# EAGLE design PCB-BI16-2x8 (EAGLE 6.5.0)

## Sheet 1 of 2
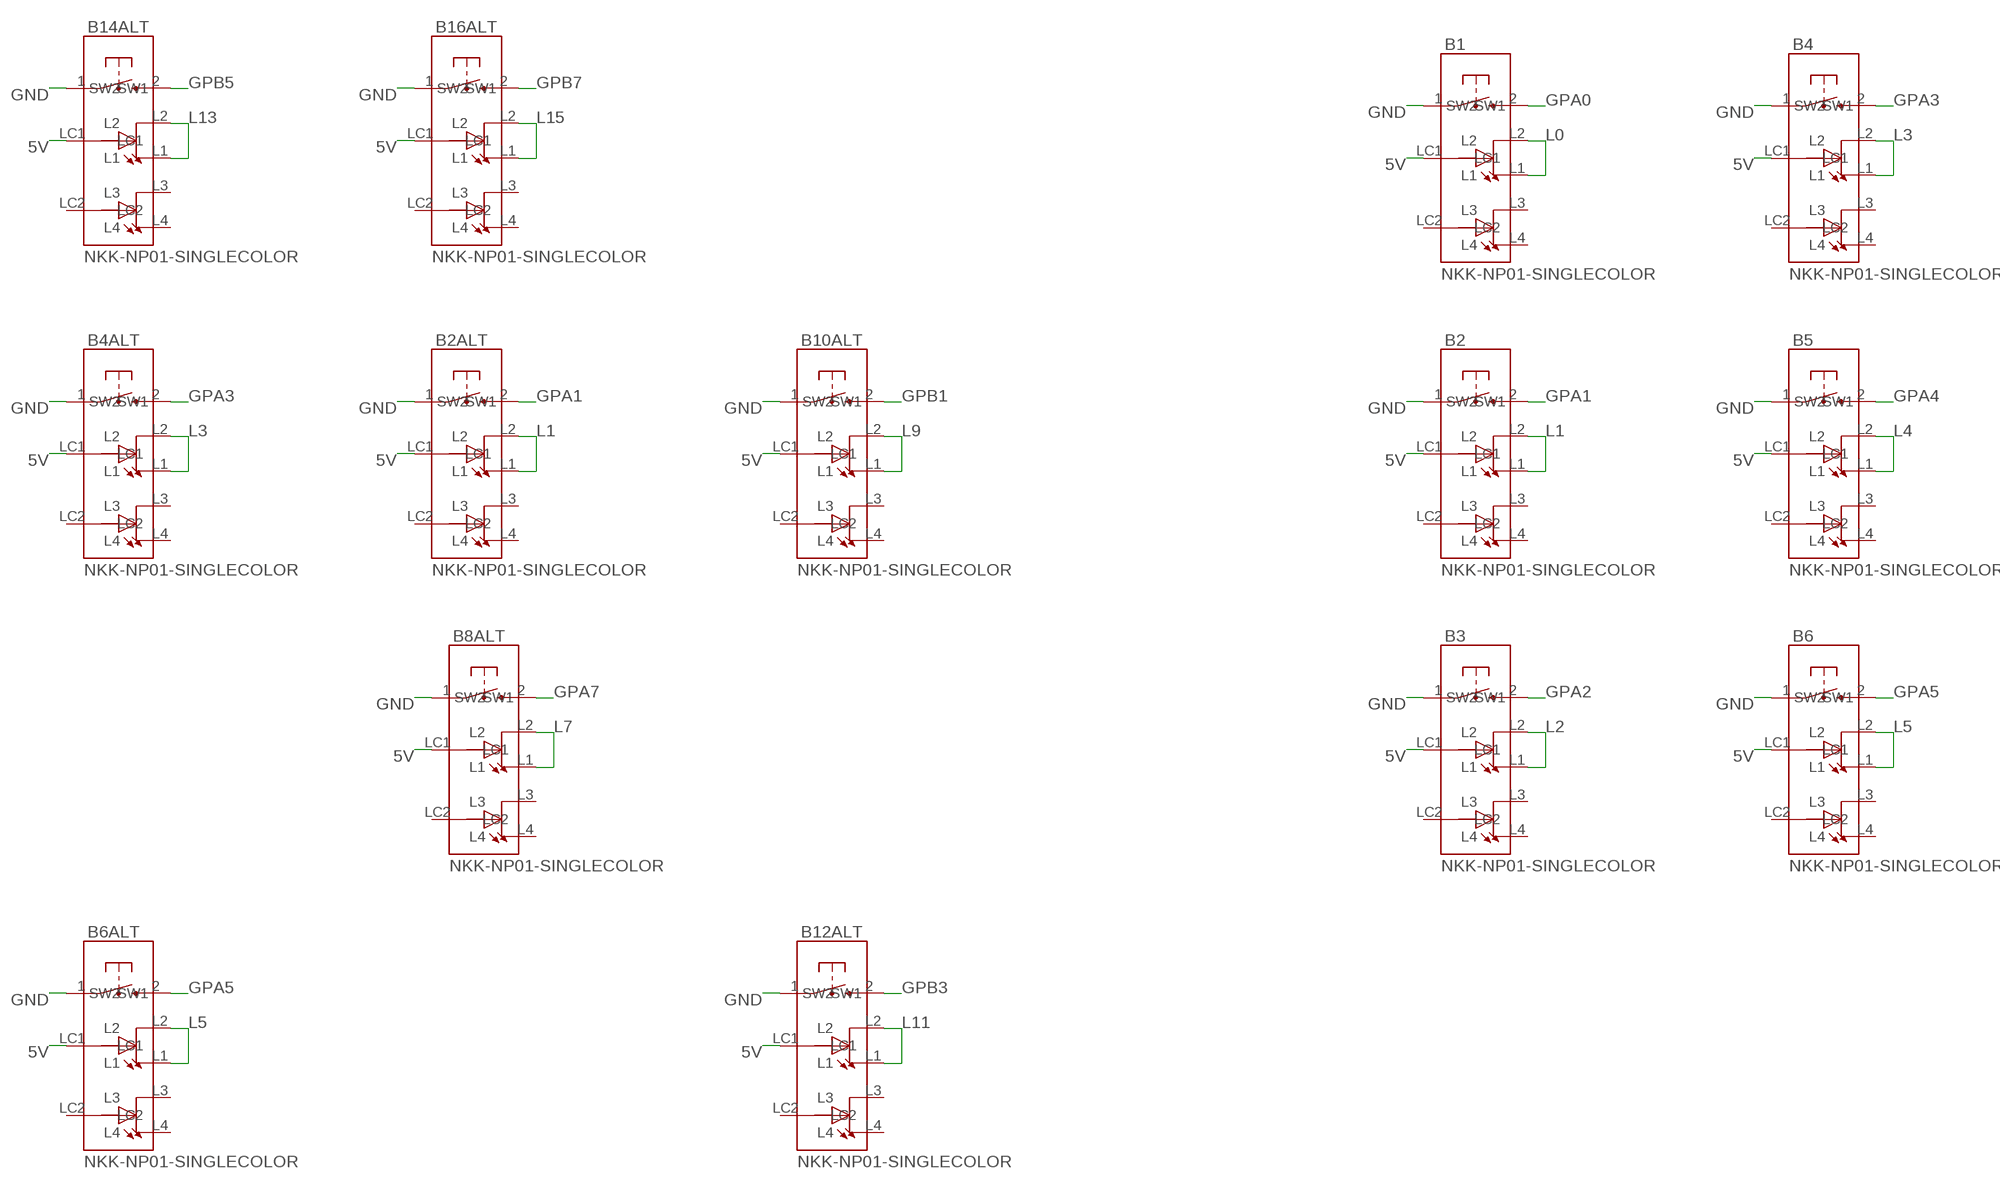
[diagram p0: schematic, sheet 1, part 1 of 2]
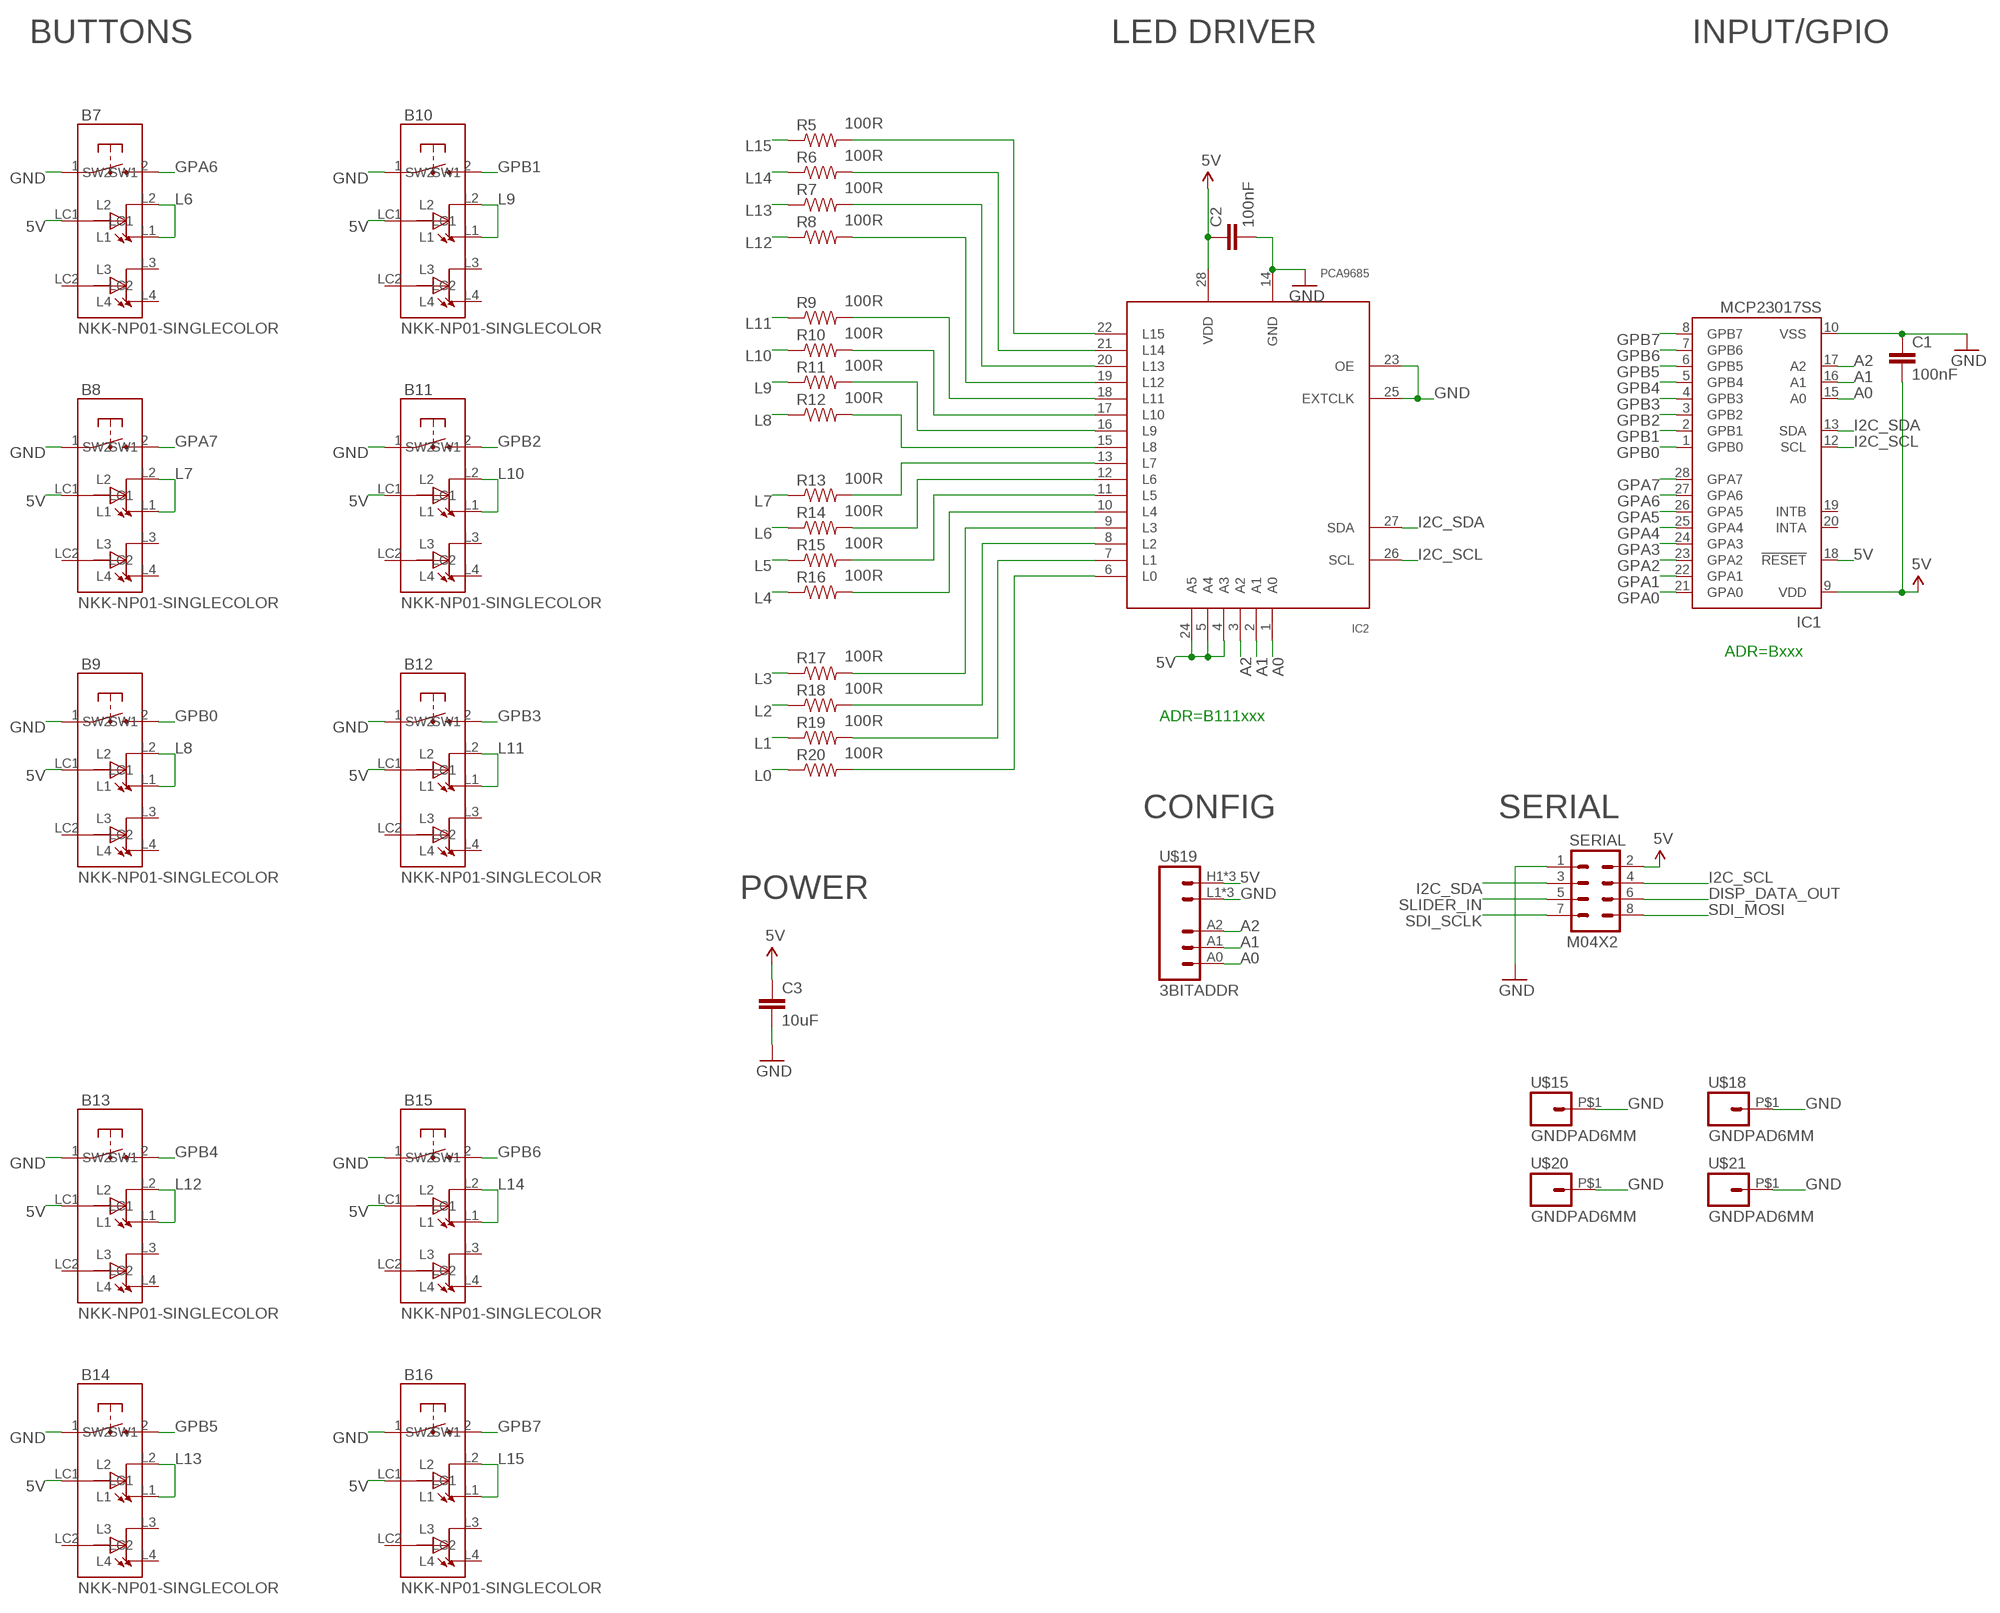
[diagram p1: schematic, sheet 1, part 2 of 2]

### Parts
B1  NKK-NP01-SINGLECOLOR  [NKK-NP01]
B2  NKK-NP01-SINGLECOLOR  [NKK-NP01]
B2ALT  NKK-NP01-SINGLECOLOR  [NKK-NP01]
B3  NKK-NP01-SINGLECOLOR  [NKK-NP01]
B4  NKK-NP01-SINGLECOLOR  [NKK-NP01]
B4ALT  NKK-NP01-SINGLECOLOR  [NKK-NP01]
B5  NKK-NP01-SINGLECOLOR  [NKK-NP01]
B6  NKK-NP01-SINGLECOLOR  [NKK-NP01]
B6ALT  NKK-NP01-SINGLECOLOR  [NKK-NP01]
B7  NKK-NP01-SINGLECOLOR  [NKK-NP01]
B8  NKK-NP01-SINGLECOLOR  [NKK-NP01]
B8ALT  NKK-NP01-SINGLECOLOR  [NKK-NP01]
B9  NKK-NP01-SINGLECOLOR  [NKK-NP01]
B10  NKK-NP01-SINGLECOLOR  [NKK-NP01]
B10ALT  NKK-NP01-SINGLECOLOR  [NKK-NP01]
B11  NKK-NP01-SINGLECOLOR  [NKK-NP01]
B12  NKK-NP01-SINGLECOLOR  [NKK-NP01]
B12ALT  NKK-NP01-SINGLECOLOR  [NKK-NP01]
B13  NKK-NP01-SINGLECOLOR  [NKK-NP01]
B14  NKK-NP01-SINGLECOLOR  [NKK-NP01]
B14ALT  NKK-NP01-SINGLECOLOR  [NKK-NP01]
B15  NKK-NP01-SINGLECOLOR  [NKK-NP01]
B16  NKK-NP01-SINGLECOLOR  [NKK-NP01]
B16ALT  NKK-NP01-SINGLECOLOR  [NKK-NP01]
C1  100nF  CAP0603-CAP  [0603-CAP]
C2  100nF  CAP0603-CAP  [0603-CAP]
C3  10uF  CAP0805  [0805]
IC1  MCP23017SS  [SSOP28]
IC2  PCA9685  [TSSOP28]
R5  100R  RESISTOR0603-RES  [0603-RES]
R6  100R  RESISTOR0603-RES  [0603-RES]
R7  100R  RESISTOR0603-RES  [0603-RES]
R8  100R  RESISTOR0603-RES  [0603-RES]
R9  100R  RESISTOR0603-RES  [0603-RES]
R10  100R  RESISTOR0603-RES  [0603-RES]
R11  100R  RESISTOR0603-RES  [0603-RES]
R12  100R  RESISTOR0603-RES  [0603-RES]
R13  100R  RESISTOR0603-RES  [0603-RES]
R14  100R  RESISTOR0603-RES  [0603-RES]
R15  100R  RESISTOR0603-RES  [0603-RES]
R16  100R  RESISTOR0603-RES  [0603-RES]
R17  100R  RESISTOR0603-RES  [0603-RES]
R18  100R  RESISTOR0603-RES  [0603-RES]
R19  100R  RESISTOR0603-RES  [0603-RES]
R20  100R  RESISTOR0603-RES  [0603-RES]
SERIAL  M04X2  [2X4]
U$15  GNDPAD6MM  [3.2MMPAD6MM]
U$18  GNDPAD6MM  [3.2MMPAD6MM]
U$19  3BITADDR  [3BITADDR]
U$20  GNDPAD6MM  [3.2MMPAD6MM]
U$21  GNDPAD6MM  [3.2MMPAD6MM]

### Nets
5V [Power]: B1.LC1 B2.LC1 B2ALT.LC1 B3.LC1 B4.LC1 B4ALT.LC1 B5.LC1 B6.LC1 B6ALT.LC1 B7.LC1 B8.LC1 B8ALT.LC1 B9.LC1 B10.LC1 B10ALT.LC1 B11.LC1 B12.LC1 B12ALT.LC1 B13.LC1 B14.LC1 B14ALT.LC1 B15.LC1 B16.LC1 B16ALT.LC1 C1.2 C2.1 C3.1 IC1.9(VDD) IC1.18(!RESET) IC2.4(A3) IC2.5(A4) IC2.24(A5) IC2.28(VDD) SERIAL.2 U$19.H1(VCC) U$19.H2(VCC) U$19.H3(VCC)
A0: IC1.15(A0) IC2.1(A0) U$19.A0
A1: IC1.16(A1) IC2.2(A1) U$19.A1
A2: IC1.17(A2) IC2.3(A2) U$19.A2
DISP_DATA_OUT: SERIAL.6
GND [Power]: B1.1(SW1) B2.1(SW1) B2ALT.1(SW1) B3.1(SW1) B4.1(SW1) B4ALT.1(SW1) B5.1(SW1) B6.1(SW1) B6ALT.1(SW1) B7.1(SW1) B8.1(SW1) B8ALT.1(SW1) B9.1(SW1) B10.1(SW1) B10ALT.1(SW1) B11.1(SW1) B12.1(SW1) B12ALT.1(SW1) B13.1(SW1) B14.1(SW1) B14ALT.1(SW1) B15.1(SW1) B16.1(SW1) B16ALT.1(SW1) C1.1 C2.2 C3.2 IC1.10(VSS) IC2.14(GND) IC2.23(OE) IC2.25(EXTCLK) SERIAL.1 U$15.P$1 U$18.P$1 U$19.L1(GND) U$19.L2(GND) U$19.L3(GND) U$20.P$1 U$21.P$1
GPA0: B1.2(SW2) IC1.21(GPA0)
GPA1: B2.2(SW2) B2ALT.2(SW2) IC1.22(GPA1)
GPA2: B3.2(SW2) IC1.23(GPA2)
GPA3: B4.2(SW2) B4ALT.2(SW2) IC1.24(GPA3)
GPA4: B5.2(SW2) IC1.25(GPA4)
GPA5: B6.2(SW2) B6ALT.2(SW2) IC1.26(GPA5)
GPA6: B7.2(SW2) IC1.27(GPA6)
GPA7: B8.2(SW2) B8ALT.2(SW2) IC1.28(GPA7)
GPB0 [Power]: B9.2(SW2) IC1.1(GPB0)
GPB1: B10.2(SW2) B10ALT.2(SW2) IC1.2(GPB1)
GPB2: B11.2(SW2) IC1.3(GPB2)
GPB3: B12.2(SW2) B12ALT.2(SW2) IC1.4(GPB3)
GPB4: B13.2(SW2) IC1.5(GPB4)
GPB5: B14.2(SW2) B14ALT.2(SW2) IC1.6(GPB5)
GPB6: B15.2(SW2) IC1.7(GPB6)
GPB7: B16.2(SW2) B16ALT.2(SW2) IC1.8(GPB7)
I2C_SCL: IC1.12(SCL) IC2.26(SCL) SERIAL.4
I2C_SDA: IC1.13(SDA) IC2.27(SDA) SERIAL.3
L0: B1.L1 B1.L2 R20.1
L1: B2.L1 B2.L2 B2ALT.L1 B2ALT.L2 R19.1
L2: B3.L1 B3.L2 R18.1
L3: B4.L1 B4.L2 B4ALT.L1 B4ALT.L2 R17.1
L4: B5.L1 B5.L2 R16.1
L5: B6.L1 B6.L2 B6ALT.L1 B6ALT.L2 R15.1
L6: B7.L1 B7.L2 R14.1
L7: B8.L1 B8.L2 B8ALT.L1 B8ALT.L2 R13.1
L8: B9.L1 B9.L2 R12.1
L9: B10.L1 B10.L2 B10ALT.L1 B10ALT.L2 R11.1
L10: B11.L1 B11.L2 R10.1
L11: B12.L1 B12.L2 B12ALT.L1 B12ALT.L2 R9.1
L12: B13.L1 B13.L2 R8.1
L13: B14.L1 B14.L2 B14ALT.L1 B14ALT.L2 R7.1
L14: B15.L1 B15.L2 R6.1
L15: B16.L1 B16.L2 B16ALT.L1 B16ALT.L2 R5.1
N$4: IC2.13(L7) R13.2
N$5: IC2.12(L6) R14.2
N$7: IC2.11(L5) R15.2
N$9: IC2.10(L4) R16.2
N$10: IC2.9(L3) R17.2
N$11: IC2.8(L2) R18.2
N$12: IC2.7(L1) R19.2
N$19: IC2.6(L0) R20.2
N$20: IC2.15(L8) R12.2
N$21: IC2.16(L9) R11.2
N$22: IC2.17(L10) R10.2
N$23: IC2.18(L11) R9.2
N$24: IC2.19(L12) R8.2
N$25: IC2.20(L13) R7.2
N$26: IC2.21(L14) R6.2
N$27: IC2.22(L15) R5.2
SDI_MOSI: SERIAL.8
SDI_SCLK: SERIAL.7
SLIDER_IN: SERIAL.5
Unconnected: B1.L3 B1.L4 B1.LC2 B2.L3 B2.L4 B2.LC2 B2ALT.L3 B2ALT.L4 B2ALT.LC2 B3.L3 B3.L4 B3.LC2 B4.L3 B4.L4 B4.LC2 B4ALT.L3 B4ALT.L4 B4ALT.LC2 B5.L3 B5.L4 B5.LC2 B6.L3 B6.L4 B6.LC2 B6ALT.L3 B6ALT.L4 B6ALT.LC2 B7.L3 B7.L4 B7.LC2 B8.L3 B8.L4 B8.LC2 B8ALT.L3 B8ALT.L4 B8ALT.LC2 B9.L3 B9.L4 B9.LC2 B10.L3 B10.L4 B10.LC2 B10ALT.L3 B10ALT.L4 B10ALT.LC2 B11.L3 B11.L4 B11.LC2 B12.L3 B12.L4 B12.LC2 B12ALT.L3 B12ALT.L4 B12ALT.LC2 B13.L3 B13.L4 B13.LC2 B14.L3 B14.L4 B14.LC2 B14ALT.L3 B14ALT.L4 B14ALT.LC2 B15.L3 B15.L4 B15.LC2 B16.L3 B16.L4 B16.LC2 B16ALT.L3 B16ALT.L4 B16ALT.LC2 IC1.19(INTB) IC1.20(INTA)

### Notes on the sheet
- BUTTONS | LED DRIVER | INPUT/GPIO
- ADR=Bxxx
- ADR=B111xxx
- CONFIG | SERIAL
- POWER

## Sheet 2 of 2

## Library data of the parts
B1 B2 B2ALT B3 B4 B4ALT B5 B6 B6ALT B7 B8 B8ALT B9 B10 B10ALT B11 B12 B12ALT B13 B14 B14ALT B15 B16 B16ALT = SKAARHOJ:NKK-NP01-SINGLECOLOR
C1-C3 = SparkFun:CAP: Capacitor Standard 0603 ceramic capacitor, and 0.1" leaded capacitor.
IC1 = microchip:MCP23017: http://ww1.microchip.com/downloads/en/DeviceDoc/21952a.pdf Source: http://ww1.microchip.com/downloads/en/DeviceDoc/21952a.pdf; MF: MICROCHIP; MPN: MCP23017-E/SS; OC_FARNELL: 1467674; OC_NEWARK: 31K2960
IC2 = wsmith:PCA9685
R5-R20 = SparkFun:RESISTOR: Resistor Basic schematic elements and footprints for 0603, 1206, and PTH resistors.
SERIAL = SparkFun:M04X2
U$15 U$18 U$20 U$21 = SKAARHOJ:GNDPAD
U$19 = SKAARHOJ:3BITADDR

## Net classes
0 default: width 0.203 mm, drill 0.305 mm, clearance 0.152 mm
1 Power: width 0.406 mm, drill 0.61 mm, clearance 0.203 mm

## Board
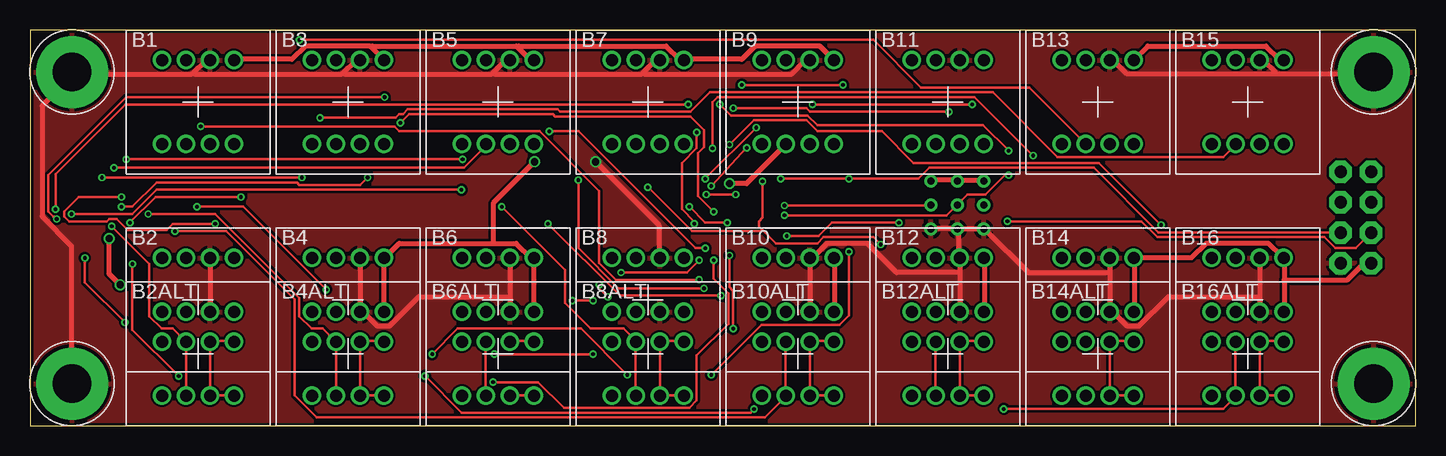
[diagram p2: board, top side]
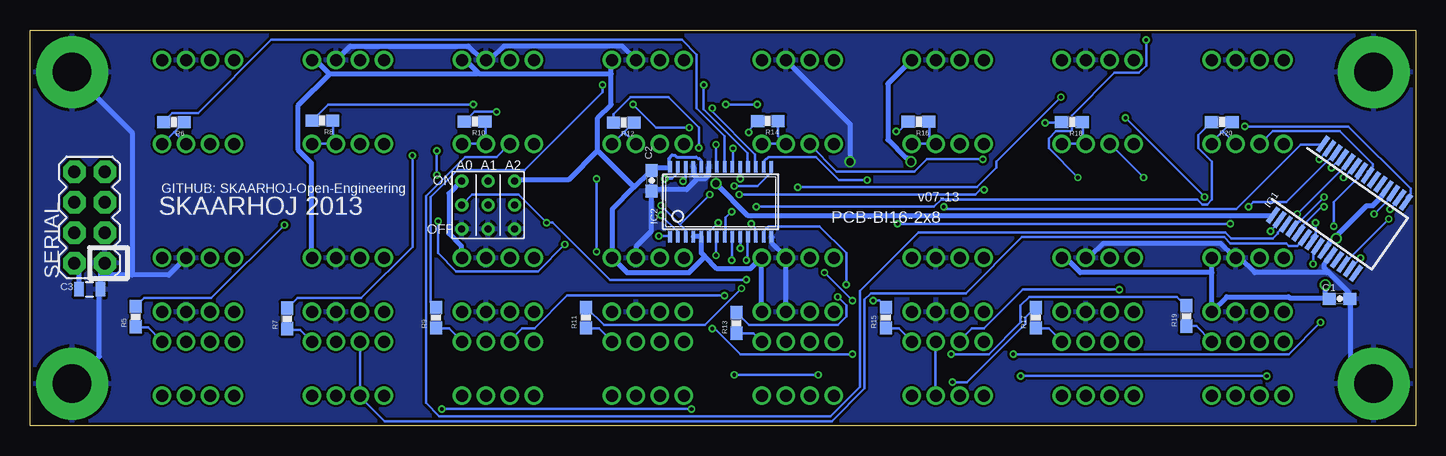
[diagram p3: board, bottom side, seen from below]

Size 115.5 x 33 mm. Coordinates in mm from the lower left corner, seen from the top.
Outline: 0,0 115.5,0 115.5,33 0,33 0,0
Copper layers (1*16): Top 0.035mm / dielectric 1.5mm / Bottom 0.035mm
Design rules "Fusion_eagle_rule_v1.1": minimum track width 6mil, minimum drill 12mil, track to track 6mil, track to pad 6mil, pad to pad 6mil, via to via 6mil, smd to smd 0mil, copper to edge 10mil, drill to drill 10mil, minimum pad ring 10mil, minimum via ring 6mil, stop-mask expansion 2mil, vias tented up to drill 100mil, thermal gap 10mil

### Footprints (pad centres in the part's own frame; a part is rotated, then mirrored left to right if it is on the bottom)
NKK-NP01 = drill 1: 1 1,3.5; 2 -1,-3.5; L1 3,-3.5; L2 1,-3.5; L3 -1,3.5; L4 -3,3.5; LC1 3,3.5; LC2 -3,-3.5
0603-CAP = smd 1.1 x 1: 1 -0.85,0; 2 0.85,0
0805 = smd 0.8 x 1.2: 1 -0.9,0; 2 0.9,0
SSOP28 = smd 0.4 x 1.5: 1 -4.225,-3.625; 2 -3.575,-3.625; 3 -2.925,-3.625; 4 -2.275,-3.625; 5 -1.625,-3.625; 6 -0.975,-3.625; 7 -0.325,-3.625; 8 0.325,-3.625; 9 0.975,-3.625; 10 1.625,-3.625; 11 2.275,-3.625; 12 2.925,-3.625; 13 3.575,-3.625; 14 4.225,-3.625; 15 4.225,3.625; 16 3.575,3.625; 17 2.925,3.625; 18 2.275,3.625; 19 1.625,3.625; 20 0.975,3.625; 21 0.325,3.625; 22 -0.325,3.625; 23 -0.975,3.625; 24 -1.625,3.625; 25 -2.275,3.625; 26 -2.925,3.625; 27 -3.575,3.625; 28 -4.225,3.625
TSSOP28 = smd 0.305 x 0.991: 1 -4.225,-2.918; 2 -3.575,-2.918; 3 -2.925,-2.918; 4 -2.275,-2.918; 5 -1.625,-2.918; 6 -0.975,-2.918; 7 -0.325,-2.918; 8 0.325,-2.918; 9 0.975,-2.918; 10 1.625,-2.918; 11 2.275,-2.918; 12 2.925,-2.918; 13 3.575,-2.918; 14 4.225,-2.918; 15 4.225,2.918; 16 3.575,2.918; 17 2.925,2.918; 18 2.275,2.918; 19 1.625,2.918; 20 0.975,2.918; 21 0.325,2.918; 22 -0.325,2.918; 23 -0.975,2.918; 24 -1.625,2.918; 25 -2.275,2.918; 26 -2.925,2.918; 27 -3.575,2.918; 28 -4.225,2.918
0603-RES = smd 1.1 x 1: 1 -0.85,0; 2 0.85,0
2X4 = drill 1.016 pad 1.88 octagon: 1 -3.81,-1.27; 2 -3.81,1.27; 3 -1.27,-1.27; 4 -1.27,1.27; 5 1.27,-1.27; 6 1.27,1.27; 7 3.81,-1.27; 8 3.81,1.27
3.2MMPAD6MM = drill 3.2 pad 6: P$1 0,0
3BITADDR = drill 0.6: A0 -2.2,0; A1 0,0; A2 2.2,0; H1 -2.2,2; H2 0,2; H3 2.2,2; L1 -2.2,-2; L2 0,-2; L3 2.2,-2

### Placement (x,y rotation side)
B1  14,27 0 top
B2  14,10.5 0 top
B2ALT  14,6 0 top
B3  26.5,27 0 top
B4  26.5,10.5 0 top
B4ALT  26.5,6 0 top
B5  39,27 0 top
B6  39,10.5 0 top
B6ALT  39,6 0 top
B7  51.5,27 0 top
B8  51.5,10.5 0 top
B8ALT  51.5,6 0 top
B9  64,27 0 top
B10  64,10.5 0 top
B10ALT  64,6 0 top
B11  76.5,27 0 top
B12  76.5,10.5 0 top
B12ALT  76.5,6 0 top
B13  89,27 0 top
B14  89,10.5 0 top
B14ALT  89,6 0 top
B15  101.5,27 0 top
B16  101.5,10.5 0 top
B16ALT  101.5,6 0 top
C1  6.33,10.58 180 bottom
C2  63.68,20.42 270 bottom
C3  110.53,11.36 0 bottom
IC1  6.33,18.1 325 bottom
IC2  57.92,18.67 0 bottom
R5  106.68,9.1 90 bottom
R6  103.51,25.3 180 bottom
R7  94.07,8.93 90 bottom
R8  91.11,25.43 180 bottom
R9  81.64,9.01 90 bottom
R10  78.43,25.36 180 bottom
R11  69.14,8.99 90 bottom
R12  66.01,25.28 180 bottom
R13  56.59,8.56 90 bottom
R14  53.99,25.41 180 bottom
R15  44.16,9.01 90 bottom
R16  41.43,25.34 180 bottom
R17  31.66,8.99 90 bottom
R18  28.64,25.31 180 bottom
R19  19.12,9.14 90 bottom
R20  16.14,25.33 180 bottom
SERIAL  110.53,17.36 90 bottom
U$15  3.5,3.5 0 top
U$18  112,3.5 0 top
U$19  77.31,18.39 0 bottom
U$20  3.5,29.5 0 top
U$21  112,29.5 0 top

### Tracks (layer width: path | path; a pad name or v marks a point on that pad's centre or on a via)
5V  (via drill 0.61)
  Top 0.406: B6ALT.LC1 41.96,9.51 41.96,13.98 B6.LC1 41.76,13.98 40.54,15.2 38.61,15.2 | B4ALT.LC1 29.46,9.51 29.46,13.98 B4.LC1 29.67,14.09 30.79,15.2 38.61,15.2 | v6.6,15.61 6.6,12.66 v7.52,11.75 | 28.45,31.56 29.46,30.54 B3.LC1 | 28.45,31.56 28.35,31.66 22.96,31.66 21.84,30.54 17.07,30.54 B1.LC1 | 40.64,31.56 40.54,31.66 28.55,31.66 28.45,31.56 | 40.64,31.56 41.66,30.54 41.96,30.54 B5.LC1 | 40.64,31.56 40.74,31.66 53.03,31.66 54.15,30.54 54.46,30.54 B7.LC1 54.66,30.54 59.33,30.54 60.45,31.66 65.84,31.66 66.95,30.54 B9.LC1 | B14ALT.LC1 92.05,9.51 92.05,13.98 B14.LC1 92.25,13.98 96.83,13.98 98.04,15.2 103.23,15.2 104.34,14.09 B16.LC1 104.55,13.98 104.55,12.15 | 104.55,12.15 104.55,9.51 B16ALT.LC1 | 104.55,12.15 109.83,12.15 111.15,13.47 111.76,13.47 SERIAL.2 | B12ALT.LC1 79.55,9.51 79.55,13.98 B12.LC1 | U$19.H3 75.18,20.49 77.22,20.49 U$19.H2 77.42,20.49 79.45,20.49 U$19.H1 | B10ALT.LC1 67.06,9.51 67.06,13.98 B10.LC1 | B15.LC1 104.44,30.54 104.14,30.54 103.02,31.66 93.17,31.66 92.05,30.54 B13.LC1 | 38.61,15.2 38.61,18.55 v42.06,22.01
  Bottom 0.254: 61.98,22.54 61.72,22.54 61.59,22.42 59.94,22.42 59.82,22.29 59.69,22.29 59.56,22.16 59.56,21.6 IC2.24
  Bottom 0.305: IC2.28 62.23,21.59 62.23,22.29 61.98,22.54
  Bottom 0.406: 6.71,15.71 7.21,15.2 7.21,15.1 7.42,14.9 7.42,14.8 7.62,14.59 IC1.9 | 6.71,15.71 4.06,18.35 3.56,18.35 2.85,19.06 2.85,19.16 2.64,19.37 2.64,19.47 2.44,19.67 IC1.18 | 16.97,12.76 16.97,9.72 B2ALT.LC1 16.97,9.51 15.75,10.73 10.57,10.73 10.46,10.63 7.21,10.63 C1.2 7.52,10.73 v7.52,11.75 | 16.97,12.76 16.97,13.98 B2.LC1 | 16.97,12.76 27.94,12.76 29.16,13.98 29.46,13.98 B4.LC1 | v6.6,15.61 6.71,15.71 | C3.1 111.45,11.44 111.45,13.17 111.76,13.47 SERIAL.2 | IC2.4 60.15,15.81 59.64,15.81 IC2.5 59.54,15.61 59.54,14.39 59.23,14.09 | 59.23,14.09 58.22,13.07 55.47,13.07 54.56,13.98 B8.LC1 54.56,13.78 54.56,9.51 B8ALT.LC1 | IC2.28 62.18,21.5 63.4,21.5 63.6,21.3 C2.1 63.8,21.2 65.13,19.88 | 65.13,19.88 66.95,18.05 66.95,14.09 B10.LC1 66.85,13.88 65.73,12.76 60.55,12.76 59.23,14.09 | 67.06,29.32 67.06,26.79 68.17,25.67 68.17,22.92 | 67.06,29.32 67.06,30.44 B9.LC1 | 65.13,19.88 68.17,22.92 | 78.13,29.43 78.03,29.32 67.06,29.32 | 78.13,29.43 79.15,30.44 79.45,30.44 B11.LC1 | 90.53,29.32 91.64,30.44 91.95,30.44 B13.LC1 | 90.53,29.32 78.23,29.32 78.13,29.43 | 68.17,22.92 70.61,20.49 75.08,20.49 U$19.H3 | B12.LC1 79.55,14.09 79.55,15 80.57,16.02 80.57,19.37 79.55,20.38 U$19.H1 | 90.53,29.32 93.17,26.68 93.17,23.03 92.05,21.91 92.05,14.09 B14.LC1 | v42.06,22.01 42.37,22.31 42.47,22.31 43.99,23.84 43.99,28.51 42.06,30.44 B5.LC1
A0  (via drill 0.3)
  Top 0.203: v63.09,15.81 65.73,15.81 66.85,16.93 v72.44,16.93 | v14.22,24.96 30.38,24.96 30.79,24.55 42.47,24.55 47.45,19.57 47.45,13.58 48.87,12.15 v55.78,12.15
  Bottom 0.203: v63.09,15.81 62.18,15.81 IC2.1 | U$19.A0 79.45,18.45 78.64,19.27 74.78,19.27 v72.44,16.93 71.93,16.93 67.16,12.15 v55.78,12.15 | v14.22,24.96 5.59,24.96 0.41,19.77 0.41,19.37 0.71,19.06 0.71,18.66 IC1.15
A1  (via drill 0.3)
  Top 0.203: v62.89,17.54 76.4,17.54 77.22,18.35 U$19.A1 77.32,18.45 78.13,19.27 79.65,19.27 81.28,20.89 v81.58,20.89 | v2.13,18.05 2.13,20.99 7.92,26.79 v54.86,26.79 | v57.51,26.79 58.42,25.87 64.82,25.87 65.63,25.06 79.45,25.06 v81.58,22.92
  Bottom 0.203: v62.89,17.54 61.57,16.22 61.57,15.81 IC2.2 | v2.13,18.05 1.42,18.76 1.42,18.96 IC1.16 | v57.51,26.79 v54.86,26.79 | v81.58,20.89 v81.58,22.92
A2  (via drill 0.3)
  Top 0.203: v62.89,18.35 75.08,18.35 U$19.A2 | v3.45,17.64 8.53,17.64 10.57,19.67 v35.97,19.67 | v58.83,19.27 v56.39,19.27
  Bottom 0.203: v62.89,18.35 61.32,16.78 | 61.32,16.78 60.86,16.32 60.86,15.81 IC2.3 | v3.45,17.64 1.93,19.16 1.93,19.37 IC1.17 | v35.97,19.67 36.27,19.67 36.68,19.27 v56.39,19.27 | 61.32,16.78 v58.83,19.27
GND  (via drill 0.61)
  Top 0.406: 102.51,10.73 102.51,13.98 B16.1 | 102.51,10.73 102.51,9.51 B16ALT.1 | B10ALT.1 65.02,9.51 65.02,13.98 B10.1 65.23,13.98 66.45,15.2 69.8,15.2 72.24,12.76 77.52,12.76 | 90.02,12.76 90.02,13.98 B14.1 | 90.02,12.76 90.02,9.51 B14ALT.1 90.22,9.51 91.44,8.29 92.46,8.29 94.89,10.73 102.51,10.73 | U$19.L3 75.18,16.42 77.22,16.42 U$19.L2 | U$19.L2 77.52,16.42 79.45,16.42 U$19.L1 79.65,16.32 83.21,12.76 90.02,12.76 | 77.52,12.76 77.52,13.98 B12.1 77.42,14.19 77.42,16.22 U$19.L2 | 77.52,12.76 77.52,9.51 B12ALT.1 | 40.03,10.73 40.03,13.98 B6.1 | 40.03,10.73 40.03,9.51 B6ALT.1 | B4.1 27.53,13.98 27.53,9.51 B4ALT.1 27.74,9.51 28.96,8.29 29.97,8.29 32.41,10.73 40.03,10.73 | B2ALT.1 15.04,9.51 15.04,13.98 B2.1 | 103.83,29.43 103.94,29.32 111.86,29.32 111.96,29.43 U$21.P$1 | 103.83,29.43 102.82,30.44 102.51,30.44 B15.1 | B13.1 90.02,30.44 90.32,30.44 91.44,29.32 103.73,29.32 103.83,29.43 | 13.61,29.43 13.51,29.32 3.66,29.32 3.56,29.43 U$20.P$1 3.56,29.22 1.02,26.68 1.02,17.44 3.45,15 3.45,3.52 U$15.P$1 | 13.61,29.43 14.63,30.44 14.94,30.44 B1.1 | 26.11,29.43 26.01,29.32 13.72,29.32 13.61,29.43 | 26.11,29.43 27.13,30.44 27.43,30.44 B3.1 | 38.61,29.43 38.51,29.32 26.21,29.32 26.11,29.43 | 38.61,29.43 39.62,30.44 39.93,30.44 B5.1 | 51.1,29.43 51,29.32 38.71,29.32 38.61,29.43 | 51.1,29.43 52.12,30.44 52.43,30.44 B7.1 | B9.1 64.92,30.44 64.62,30.44 63.5,29.32 51.21,29.32 51.1,29.43 | v47.14,22.01 52.43,16.73 52.43,14.09 B8.1
  Bottom 0.406: 109.63,12.56 109.63,13.17 109.32,13.47 SERIAL.1 | 109.63,12.56 109.63,11.44 C3.2 109.73,11.24 109.73,5.75 111.96,3.52 U$18.P$1 | 106.98,12.56 103.94,12.56 102.51,13.98 B16.1 | 106.98,12.56 109.63,12.56 | 59.84,20.59 59.23,20.59 58.93,20.89 58.93,21.5 IC2.23 | 59.84,20.59 60.15,20.89 60.15,21.5 IC2.25 | 59.84,20.59 60.76,19.67 63.6,19.67 C2.2 63.7,19.37 63.7,16.22 64.92,15 64.92,14.09 B10.1 | U$15.P$1 3.56,3.52 5.38,5.35 5.38,10.53 C1.1 5.59,10.73 5.59,11.14 7.32,12.87 | 7.32,12.87 7.62,13.17 7.62,13.47 7.42,13.68 7.42,13.78 7.11,14.09 7.11,14.19 IC1.10 | 7.32,12.87 7.42,12.76 13.41,12.76 14.63,13.98 14.94,13.98 B2.1 15.14,14.09 16.26,15.2 26.01,15.2 27.13,14.09 27.43,14.09 B4.1 | B13.1 89.92,30.54 88.8,31.66 78.94,31.66 77.83,30.54 77.52,30.54 B11.1 77.32,30.54 77.11,30.54 76,31.66 66.14,31.66 65.02,30.54 B9.1 | IC2.14 53.65,15.71 53.65,15.2 52.53,14.09 B8.1 52.53,13.88 52.53,9.51 B8ALT.1 | v47.14,22.01 47.14,25.16 52.43,30.44 B7.1 | 106.98,12.56 106.98,24.45 111.96,29.43 U$21.P$1
  pour Top: 0,0 115.5,0 115.5,33 0,33
  pour Bottom: 0,0 115.5,0 115.5,33 0,33
GPA0
  Bottom 0.203: IC1.21 3.96,20.89 3.96,21.2 3.56,21.6 3.56,21.81 6.3,24.55 11.89,24.55 12.9,23.53 B1.2
GPA1  (via drill 0.3)
  Top 0.203: v6.81,16.62 9.96,13.47 9.96,9.11 10.97,8.09 11.89,8.09 12.9,7.07 B2.2 13.01,6.97 B2ALT.2
  Bottom 0.203: v6.81,16.62 6.81,18.66 4.57,20.89 4.57,21.2 IC1.22
GPA2  (via drill 0.3)
  Top 0.203: v22.66,20.69 v5.99,20.69
  Bottom 0.203: v5.99,20.69 5.08,21.6 IC1.23 | v22.66,20.69 25.4,23.43 B3.2
GPA3  (via drill 0.3)
  Top 0.203: v9.86,17.64 15.44,17.64 22.45,10.63 22.45,9.11 23.47,8.09 24.38,8.09 25.4,7.07 B4.2 25.5,6.97 B4ALT.2
  Bottom 0.203: v9.86,17.64 5.59,21.91 IC1.24
GPA4  (via drill 0.3)
  Top 0.203: v7.01,21.5 36.17,21.5 38.1,23.43 B5.2
  Bottom 0.203: v7.01,21.5 6.2,22.31 IC1.25
GPA5  (via drill 0.3)
  Top 0.203: v13.92,18.25 17.78,18.25 v24.69,11.34 | B6ALT.2 38,6.97 B6.2
  Bottom 0.203: v13.92,18.25 13.51,18.66 10.77,18.66 6.71,22.72 IC1.26 | v24.69,11.34 32.72,11.34 35.97,8.09 36.98,8.09 38,7.07 B6.2
GPA6  (via drill 0.3)
  Top 0.203: v36.07,22.21 v8.03,22.21
  Bottom 0.203: v8.03,22.21 7.21,23.03 IC1.27 | v36.07,22.21 40.74,22.21 41.76,21.2 48.26,21.2 50.49,23.43 B7.2
GPA7  (via drill 0.3)
  Top 0.203: v39.32,18.25 44.6,12.97 44.6,10.22 46.74,8.09 49.48,8.09 50.49,7.07 B8.2 50.49,6.97 B8ALT.2
  Bottom 0.203: v39.32,18.25 39.12,18.05 14.94,18.05 9.55,23.43 7.72,23.43 IC1.28
GPB0  (via drill 0.61)
  Top 0.406: v58.32,20.18 59.74,20.18 62.99,23.43 B9.2
  Bottom 0.406: v58.32,20.18 55.68,17.54 11.89,17.54 IC1.1
GPB1  (via drill 0.3)
  Top 0.203: v12.09,16.22 16.36,16.22 22.05,10.53 22.05,2.5 23.88,0.67 61.27,0.67 62.99,2.4 B10ALT.2 62.99,6.97 B10.2
  Bottom 0.203: v12.09,16.22 11.38,16.93 11.38,17.13 IC1.2
GPB2
  Bottom 0.203: IC1.3 10.87,16.73 11.48,16.12 11.48,16.02 11.89,15.61 15.34,15.61 15.85,16.12 41.45,16.12 46.33,11.24 46.33,3.21 48.77,0.78 81.38,0.78 82.5,1.89 82.5,19.16 79.25,22.42 76.61,22.42 75.59,23.43 B11.2
GPB3  (via drill 0.3)
  Top 0.203: v7.62,19.06 4.06,19.06 2.85,17.84 2.85,17.44 3.25,17.03 6.4,17.03 6.6,17.23 7.21,17.23 8.13,16.32 11.38,16.32 11.89,16.83 v15.44,16.83 | v43.18,16.83 49.17,10.83 v57.61,10.83 | B12ALT.2 75.49,6.97 B12.2
  Bottom 0.203: v7.62,19.06 9.65,17.03 9.75,17.03 10.26,16.52 IC1.4 | v43.18,16.83 v15.44,16.83 | v57.61,10.83 70.71,10.83 73.46,8.09 74.47,8.09 75.49,7.07 B12.2
GPB4  (via drill 0.3)
  Top 0.203: v7.62,18.25 8.53,18.25 10.57,20.28 22.25,20.28 22.45,20.08 27.53,20.08 v28.14,20.69 | v22.45,32.17 70.31,32.17 74.27,28.21 83.31,28.21 87.99,23.53 B13.2
  Bottom 0.203: v7.62,18.25 7.82,18.25 9.65,16.42 9.65,16.12 IC1.5 | v28.14,20.69 30.58,23.13 30.58,23.94 29.97,24.55 28.75,24.55 28.65,24.65 28.65,25.87 25.09,29.43 23.06,29.43 22.45,30.04 v22.45,32.17
GPB5
  Bottom 0.203: IC1.6 9.25,15.61 9.86,15 10.57,15 10.77,15.2 15.44,15.2 15.95,15.71 32.82,15.71 37.49,11.04 45.41,11.04 45.92,10.53 45.92,3.11 48.67,0.37 85.95,0.37 87.99,2.4 B14ALT.2 87.99,2.6 87.99,6.97 B14.2
GPB6  (via drill 0.3)
  Top 0.203: v8.33,16.93 10.46,19.06 v17.58,19.06 | v24.18,25.67 30.48,25.67 30.79,25.97 31.09,25.97 31.5,26.38 43.99,26.38 44.2,26.18 55.07,26.18 56.69,27.8 80.26,27.8 85.65,22.42 99.47,22.42 100.48,23.43 B15.2
  Bottom 0.203: v8.33,16.93 8.33,16.02 8.64,15.71 8.64,15.41 IC1.7 | v24.18,25.67 v17.58,19.06
GPB7  (via drill 0.3)
  Top 0.203: v8.53,13.47 8.53,7.99 v12.39,4.13 | v32.92,4.13 35.97,1.08 60.05,1.08 v60.35,1.39 | v81.18,1.39 99.47,1.39 100.48,2.4 B16ALT.2 100.48,2.6 100.48,6.97 B16.2
  Bottom 0.203: v8.53,13.47 8.53,14.29 8.23,14.59 8.23,14.9 IC1.8 | v32.92,4.13 v12.39,4.13 | v81.18,1.39 v60.35,1.39
I2C_SCL  (via drill 0.3)
  Top 0.203: v61.06,20.38 61.06,17.34 60.76,17.03 60.76,16.62 61.11,16.27 | 61.11,16.27 62.18,15.2 65.63,15.2 66.14,15.71 70.31,15.71 v70.92,15.1 | v81.48,17.03 92.66,17.03 93.98,15.71 107.9,15.71 108.81,14.8 110.54,14.8 111.76,16.02 SERIAL.4 | v2.23,17.23 2.03,17.44 1.93,17.44 1.52,17.84 1.52,20.89 8.03,27.39 v29.57,27.39 | v51.51,19.88 55.17,16.22 61.06,16.22 61.11,16.27
  Bottom 0.203: v61.06,20.38 60.86,20.59 60.86,21.5 IC2.26 | v70.92,15.1 73.15,12.87 79.96,12.87 81.48,14.39 v81.48,17.03 | v2.23,17.23 5.99,13.47 IC1.12 | v29.57,27.39 34.95,22.01 34.95,21.5 36.58,19.88 v51.51,19.88
I2C_SDA  (via drill 0.3)
  Top 0.203: v62.59,20.59 v68.28,20.59 74.07,20.59 74.98,21.5 88.7,21.5 94.08,16.12 109.22,16.12 SERIAL.3 | v4.57,13.98 4.57,11.95 v7.92,8.6 | v33.53,5.96 35.66,8.09 45.92,8.09 v49.78,4.23 | v56.79,4.23 60.96,8.39 67.46,8.39 68.28,9.21 v68.28,14.49
  Bottom 0.203: v62.59,20.59 61.98,20.59 61.57,20.99 61.57,21.5 IC2.27 | v4.57,13.98 5.38,13.17 IC1.13 | v7.92,8.6 10.57,5.96 v33.53,5.96 | v56.79,4.23 v49.78,4.23 | v68.28,20.59 v68.28,14.49
L0
  Bottom 0.203: 16.05,24.55 17.07,23.53 B1.L1 | 16.05,24.55 15.34,25.26 R20.1 | 16.05,24.55 15.04,23.53 B1.L2
L1
  Top 0.203: B2ALT.L1 16.97,2.5 15.04,2.5 B2ALT.L2 15.04,2.6 15.04,6.97 B2.L2 15.04,7.07 16.97,7.07 B2.L1
  Bottom 0.203: R19.1 19.1,8.29 18.29,8.29 17.07,7.07 B2.L1
L2
  Bottom 0.203: R18.1 27.74,25.26 27.74,23.74 B3.L2 27.64,23.53 29.46,23.53 B3.L1
L3
  Top 0.203: B4ALT.L1 29.46,2.5 27.53,2.5 B4ALT.L2 27.53,2.6 27.53,6.97 B4.L2 27.53,7.07 29.46,7.07 B4.L1
  Bottom 0.203: R17.1 31.6,8.09 30.58,8.09 29.57,7.07 B4.L1
L4
  Bottom 0.203: R16.1 40.54,25.26 40.54,24.04 40.03,23.53 B5.L2 40.13,23.53 41.96,23.53 B5.L1
L5
  Top 0.203: B6ALT.L2 40.03,2.5 41.96,2.5 B6ALT.L1 | B6.L2 40.03,7.07 41.96,7.07 B6.L1
  Bottom 0.203: R15.1 44.09,8.09 43.08,8.09 42.06,7.07 B6.L1 | B6ALT.L2 40.03,2.5 40.03,6.97 B6.L2
L6
  Bottom 0.203: R14.1 53.14,25.36 53.14,24.14 52.53,23.53 B7.L2 52.63,23.53 54.46,23.53 B7.L1
L7
  Top 0.203: B8ALT.L1 54.46,2.5 52.53,2.5 B8ALT.L2 52.53,2.6 52.53,6.97 B8.L2 52.53,7.07 54.46,7.07 B8.L1
  Bottom 0.203: R13.1 56.49,7.68 55.17,7.68 54.56,7.07 B8.L1
L8
  Bottom 0.203: 65.99,24.5 66.95,23.53 B9.L1 | 65.99,24.5 65.23,25.26 R12.1 | 65.99,24.5 65.02,23.53 B9.L2
L9
  Top 0.203: B10ALT.L1 66.95,2.5 65.02,2.5 B10ALT.L2 65.02,2.6 65.02,6.97 B10.L2 65.02,7.07 66.95,7.07 B10.L1
  Bottom 0.203: R11.1 69.09,8.09 68.07,8.09 67.06,7.07 B10.L1
L10
  Bottom 0.203: R10.1 77.52,25.26 77.52,23.53 B11.L2 77.62,23.53 79.45,23.53 B11.L1
L11
  Top 0.203: B12ALT.L1 79.45,2.5 77.52,2.5 B12ALT.L2 77.52,2.6 77.52,6.97 B12.L2 77.52,7.07 79.45,7.07 B12.L1
  Bottom 0.203: R9.1 81.58,8.09 80.57,8.09 79.55,7.07 B12.L1
L12
  Bottom 0.203: R8.1 90.22,25.36 90.22,23.74 90.02,23.53 B13.L2 90.12,23.53 91.95,23.53 B13.L1
L13
  Top 0.203: B14ALT.L1 91.95,2.5 90.02,2.5 B14ALT.L2 90.02,2.6 90.02,6.97 B14.L2 90.02,7.07 91.95,7.07 B14.L1
  Bottom 0.203: R7.1 93.98,7.99 92.96,7.99 92.05,7.07 B14.L1
L14
  Bottom 0.203: 103.48,24.5 104.44,23.53 B15.L1 | 103.48,24.5 102.72,25.26 R6.1 | 103.48,24.5 102.51,23.53 B15.L2
L15
  Top 0.203: B16ALT.L1 104.44,2.5 102.51,2.5 B16ALT.L2 102.51,2.6 102.51,6.97 B16.L2 102.51,7.07 104.44,7.07 B16.L1
  Bottom 0.203: R5.1 106.58,8.19 105.66,8.19 104.55,7.07 B16.L1
N$4  (via drill 0.3)
  Top 0.203: v47.45,11.75 47.45,11.44 v48.16,10.73
  Bottom 0.203: v47.45,11.75 47.45,14.39 49.68,16.62 53.95,16.62 54.25,16.32 54.25,15.81 IC2.13 | v48.16,10.73 47.45,10.02 47.45,9.11 48.16,8.39 55.58,8.39 56.49,9.31 R13.2
N$5  (via drill 0.3)
  Top 0.203: v55.37,16.83 55.37,17.03 54.36,18.05 54.36,21.91 55.58,23.13 v55.58,24.45
  Bottom 0.203: v55.37,16.83 55.07,16.52 55.07,15.81 IC2.12 | v55.58,24.45 55.58,24.65 54.86,25.36 R14.2
N$7  (via drill 0.3)
  Top 0.203: v55.78,13.78 54.76,12.76 v49.28,12.76 | v45.21,10.43 v46.94,10.43
  Bottom 0.203: v55.78,13.78 55.68,13.88 55.68,15.71 IC2.11 | v46.94,10.43 v49.28,12.76 | v45.21,10.43 44.7,10.43 44.2,9.92 R15.2
N$9  (via drill 0.3)
  Top 0.203: v56.29,14.8 55.47,14.8 45.72,24.55 v43.28,24.55
  Bottom 0.203: v56.29,14.8 56.29,15.71 IC2.10 | v43.28,24.55 43.08,24.55 42.37,25.26 R16.2
N$10  (via drill 0.3)
  Top 0.203: v57,13.78 57,12.26 58.22,11.04 58.22,8.5 55.58,5.86 55.58,2.1 54.97,1.49 44.5,1.49 42.37,3.62 v38.61,3.62
  Bottom 0.203: v57,13.78 57,15.71 IC2.9 | v38.61,3.62 37.39,3.62 32.51,8.5 32.51,9.01 31.7,9.82 R17.2
N$11  (via drill 0.3)
  Top 0.203: v57,17.84 55.68,19.16 55.68,22.72 56.19,23.23 56.19,24.65 55.07,25.77 43.79,25.77 43.59,25.97 31.6,25.97 v30.89,25.26
  Bottom 0.203: v57,17.84 57.51,17.34 57.51,15.81 IC2.8 | v30.89,25.26 29.57,25.26 R18.2
N$12  (via drill 0.3)
  Top 0.203: v58.32,14.19 58.32,11.54 58.62,11.24 v58.62,8.09 | v38.71,5.96 v46.94,5.96
  Bottom 0.203: v58.32,14.19 58.32,15.71 IC2.7 | v58.62,8.09 58.42,8.09 56.29,5.96 v46.94,5.96 | v38.71,5.96 35.56,5.96 32.92,8.6 32.92,10.02 32.21,10.73 19.91,10.73 19.2,10.02 R19.2
N$19  (via drill 0.3)
  Top 0.203: v58.12,16.93 56.29,16.93 v54.97,18.25
  Bottom 0.203: v58.12,16.93 58.83,16.22 58.83,15.81 IC2.6 | v54.97,18.25 40.13,18.25 39.52,18.86 18.19,18.86 17.78,18.45 17.37,18.45 16.97,18.86 16.97,22.01 18.09,23.13 18.09,24.25 17.07,25.26 R20.2
N$20  (via drill 0.3)
  Top 0.203: v59.74,23.18 v56.79,19.98
  Bottom 0.203: v56.79,19.98 54.86,19.98 53.75,21.09 53.75,21.5 IC2.15 | v59.74,23.18 59.74,24.85 62.28,27.39 65.43,27.39 66.85,25.97 66.85,25.36 R12.2
N$21  (via drill 0.3)
  Top 0.203: v45.72,20.49 45.72,14.8 49.07,11.44 v56.19,11.44
  Bottom 0.203: v45.72,20.49 48.06,20.49 49.99,22.42 53.95,22.42 54.25,22.11 54.25,21.6 IC2.16 | v56.19,11.44 59.23,8.39 67.67,8.39 69.09,9.82 R11.2
N$22  (via drill 0.3)
  Top 0.203: v58.62,26.48 64.72,26.48 65.02,26.18 v76.61,26.18
  Bottom 0.203: v58.62,26.48 58.62,26.18 55.07,22.62 55.07,21.6 IC2.17 | v76.61,26.18 78.44,26.18 79.25,25.36 R10.2
N$23  (via drill 0.3)
  Top 0.203: v67.77,28.41 v59.33,28.41
  Bottom 0.203: v59.33,28.41 59.33,26.38 55.68,22.72 55.68,21.6 IC2.18 | v67.77,28.41 67.77,27.8 74.27,21.3 79.86,21.3 82.09,19.06 82.09,10.33 81.69,9.92 R9.2
N$24  (via drill 0.3)
  Top 0.203: v60.55,24.85 v56.29,20.59 | v78.54,26.79 v65.23,26.79
  Bottom 0.203: v56.29,20.59 56.29,21.5 IC2.19 | v60.55,24.85 63.3,24.85 v65.23,26.79 | v78.54,26.79 90.63,26.79 91.95,25.46 R8.2
N$25  (via drill 0.3)
  Top 0.203: v56.9,23.13 56.9,26.99 57.3,27.39 78.74,27.39 v83.62,22.52
  Bottom 0.203: v56.9,23.13 56.9,21.6 IC2.20 | v83.62,22.52 83.62,14.9 87.88,10.63 93.17,10.63 93.98,9.82 R7.2
N$26
  Bottom 0.203: IC2.21 57.61,21.6 57.61,24.14 59.94,26.48 59.94,30.95 61.16,32.17 95.4,32.17 101.5,26.07 103.63,26.07 104.34,25.36 R6.2
N$27  (via drill 0.3)
  Top 0.203: v58.32,23.43 60.35,25.46 64.72,25.46 65.63,24.55 71.02,24.55 73.66,21.91 89.1,21.91 v94.28,16.73
  Bottom 0.203: v58.32,23.43 58.32,21.6 IC2.22 | v94.28,16.73 100.38,10.63 105.97,10.63 106.58,10.02 R5.2

### Text on the board
_bsilk: v07-13 | GITHUB: SKAARHOJ-Open-Engineering | SKAARHOJ 2013 | PCB-BI16-2x8